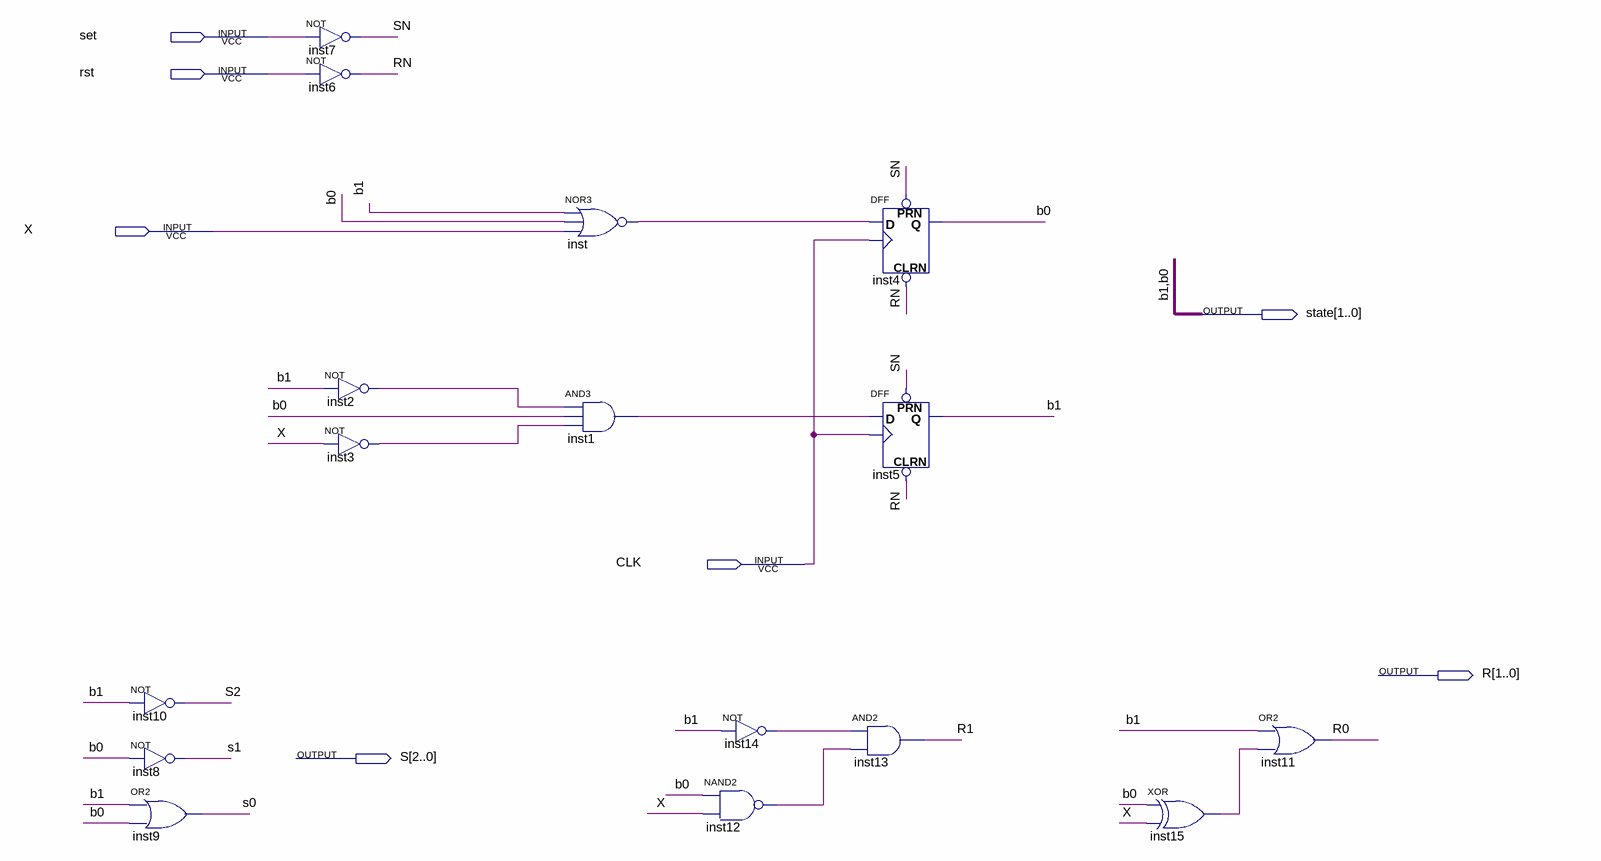
[diagram p0: schematic sheet]
// Quartus schematic FSM.bdf as structural Verilog: 16 symbols, 7 pins
module FSM (
  input  set,
  input  rst,
  input  X,
  input  CLK,
  output [1:0] state,
  output [1:0] R,
  output [2:0] S
);

  wire inst1_out, inst2_out, inst3_out, inst12_out, inst14_out, inst15_out, inst_out, RN, SN;

  not inst10 (S[2], state[1]);
  not inst8 (S[1], state[0]);
  or inst9 (S[0], state[1], state[0]);
  not inst7 (SN, set);
  not inst6 (RN, rst);
  not inst2 (inst2_out, state[1]);
  not inst3 (inst3_out, X);
  nor inst (inst_out, state[1], state[0], X);
  and inst1 (inst1_out, inst2_out, state[0], inst3_out);
  not inst14 (inst14_out, state[1]);
  nand inst12 (inst12_out, state[0], X);
  DFF inst4 (.CLRN(RN), .CLK(CLK), .D(inst_out), .PRN(SN), .Q(state[0]));
  DFF inst5 (.CLRN(RN), .CLK(CLK), .D(inst1_out), .PRN(SN), .Q(state[1]));
  and inst13 (R[1], inst14_out, inst12_out);
  xor inst15 (inst15_out, state[0], X);
  or inst11 (R[0], state[1], inst15_out);

  // Other names for the same wires on the sheet: b0 = state[0]; b1 = state[1]
endmodule
